# EAGLE design Arduino-Pro-v16 (EAGLE 7.4.0)
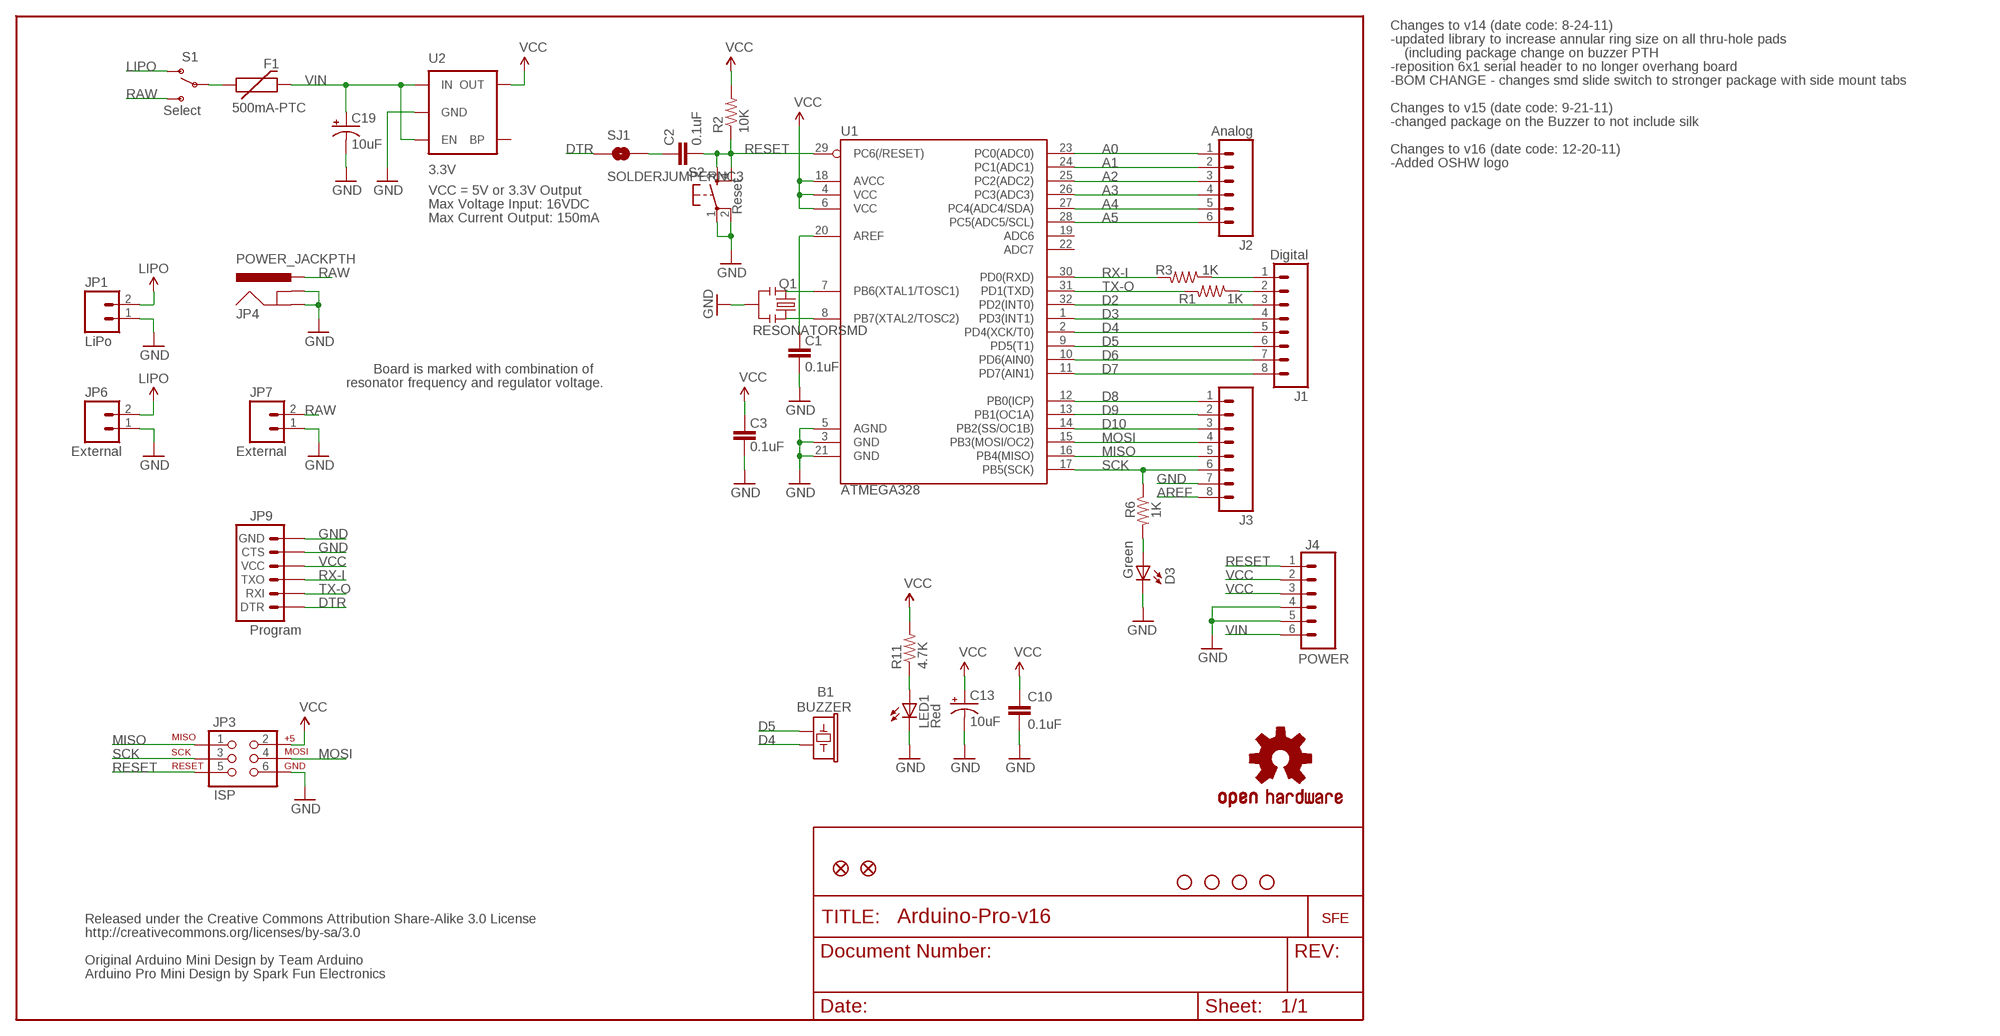
[diagram p0: schematic, sheet 1]

## Parts
B1  BUZZER  BUZZERPTH-NS-KIT  [BUZZER-12MM-NS-KIT]
C1  0.1uF  CAP0402-CAP  [0402-CAP]
C2  0.1uF  CAP0402-CAP  [0402-CAP]
C3  0.1uF  CAP0402-CAP  [0402-CAP]
C10  0.1uF  CAP0402-CAP  [0402-CAP]
C13  10uF  CAP_POL1206  [EIA3216]
C19  10uF  CAP_POL1206  [EIA3216]
D3  Green  LED0603  [LED-0603]
F1  500mA-PTC  PTCSMD  [PTC-1206]
J1  Digital  M081X08  [1X08]
J2  Analog  M06SIP  [1X06]
J3  M081X08  [1X08]
J4  POWER  M06SIP  [1X06]
JP1  LiPo  M02-JST-2MM-SMT  [JST-2-SMD]
JP2  FIDUCIAL1X2.5  [FIDUCIAL-1X2.5]
JP3  ISP  AVR_SPI_PRG_6PTH  [2X3]
JP4  POWER_JACKPTH  [POWER_JACK_PTH]
JP5  FIDUCIAL1X2.5  [FIDUCIAL-1X2.5]
JP6  External  M02PTH  [1X02]
JP7  External  M02PTH  [1X02]
JP9  Program  ARDUINO_SERIAL_PROGRAMSMD  [1X06-SMD]
LED1  Red  LED0603  [LED-0603]
Q1  RESONATORSMD  [RESONATOR-SMD]
R1  1K  RESISTOR0402-RES  [0402-RES]
R2  10K  RESISTOR0402-RES  [0402-RES]
R3  1K  RESISTOR0402-RES  [0402-RES]
R6  1K  RESISTOR0402-RES  [0402-RES]
R11  4.7K  RESISTOR0402-RES  [0402-RES]
S1  Select  SWITCH-SPST-SMD-A  [SWITCH-SPST-SMD-A]
S2  Reset  TAC_SWITCHSMD  [TACTILE_SWITCH_SMD]
SJ1  SOLDERJUMPERNC3  SOLDERJUMPERNC2  [SJ_2S-NOTRACE]
U1  ATMEGA328  ATMEGA168  [TQFP32-08]
U2  3.3V  V_REG_LDOSMD  [SOT23-5]
U$1  STAND-OFF  [STAND-OFF]
U$2  OSHW-LOGOL  [OSHW-LOGO-L]
U$3  STAND-OFF  [STAND-OFF]
U$9  STAND-OFF  [STAND-OFF]
U$10  STAND-OFF  [STAND-OFF]
U$11  LOGO-SFENEW  [SFE-NEW-WEBLOGO]

## Nets
A0: J2.1 U1.23(PC0(ADC0))
A1: J2.2 U1.24(PC1(ADC1))
A2: J2.3 U1.25(PC2(ADC2))
A3: J2.4 U1.26(PC3(ADC3))
A4: J2.5 U1.27(PC4(ADC4/SDA))
A5: J2.6 U1.28(PC5(ADC5/SCL))
AREF: C1.2 J3.8 U1.20(AREF)
D2: J1.3 U1.32(PD2(INT0))
D3: J1.4 U1.1(PD3(INT1))
D4: B1.- J1.5 U1.2(PD4(XCK/T0))
D5: B1.+ J1.6 U1.9(PD5(T1))
D6: J1.7 U1.10(PD6(AIN0))
D7: J1.8 U1.11(PD7(AIN1))
D8: J3.1 U1.12(PB0(ICP))
D9: J3.2 U1.13(PB1(OC1A))
D10: J3.3 U1.14(PB2(SS/OC1B))
DTR: JP9.1(DTR) SJ1.1
GND [vcc]: C1.1 C3.1 C10.2 C13.C(-) C19.C(-) D3.C J3.7 J4.4 J4.5 JP1.1 JP3.6 JP4.GND JP4.GNDBREAK JP6.1 JP7.1 JP9.5(CTS) JP9.6(GND) LED1.C Q1.2 S2.1 S2.2 U1.3(GND) U1.5(AGND) U1.21(GND) U2.2(GND)
LIPO: JP1.2 JP6.2 S1.1(O)
MISO: J3.5 JP3.1 U1.16(PB4(MISO))
MOSI: J3.4 JP3.4 U1.15(PB3(MOSI/OC2))
N$1: C2.1 SJ1.2
N$3: Q1.1 U1.8(PB7(XTAL2/TOSC2))
N$4: Q1.3 U1.7(PB6(XTAL1/TOSC1))
N$7: D3.A R6.2
N$25: F1.1 S1.2(P)
N$38: LED1.A R11.1
RAW [vcc]: JP4.PWR JP7.2 S1.3(S)
RESET: C2.2 J4.1 JP3.5 R2.1 S2.3 S2.4 U1.29(PC6(/RESET))
RX-I: JP9.3(TXO) R3.2 U1.30(PD0(RXD))
RX-IP: J1.2 R1.1
SCK: J3.6 JP3.3 R6.1 U1.17(PB5(SCK))
TX-O: JP9.2(RXI) R1.2 U1.31(PD1(TXD))
TX-OP: J1.1 R3.1
VCC: C3.2 C10.1 C13.A(+) J4.2 J4.3 JP3.2 JP9.4(VCC) R2.2 R11.2 U1.4(VCC) U1.6(VCC) U1.18(AVCC) U2.5(OUT)
VIN [vcc]: C19.A(+) F1.2 J4.6 U2.1(IN) U2.3(EN)
Unconnected: U1.19(ADC6) U1.22(ADC7) U2.4(BP)

## Notes on the sheet
- Changes to v14 (date code: 8-24-11)
- -updated library to increase annular ring size on all thru-hole pads
- (including package change on buzzer PTH
- -reposition 6x1 serial header to no longer overhang board
- -BOM CHANGE - changes smd slide switch to stronger package with side mount tabs
- Changes to v15 (date code: 9-21-11)
- -changed package on the Buzzer to not include silk
- Changes to v16 (date code: 12-20-11)
- -Added OSHW logo
- VCC = 5V or 3.3V Output
- Max Voltage Input: 16VDC
- Max Current Output: 150mA
- Board is marked with combination of
- resonator frequency and regulator voltage.
- Released under the Creative Commons Attribution Share-Alike 3.0 License
- http://creativecommons.org/licenses/by-sa/3.0
- Original Arduino Mini Design by Team Arduino
- Arduino Pro Mini Design by Spark Fun Electronics

## Library data of the parts
B1 = SparkFun:BUZZER: Buzzer 12mm Spark Fun Electronics SKU : Comp-Buzzer
C1-C3 C10 = SparkFun:CAP: Capacitor Standard 0603 ceramic capacitor, and 0.1" leaded capacitor.
C13 C19 = SparkFun:CAP_POL: Capacitor Polarized These are standard SMD and PTH capacitors. Normally 10uF, 47uF, and 100uF in electrolytic and tantalum varieties. Always verify the external diameter of the through hole cap, it varies with capacity, voltage, and manufacturer. The EIA devices should be standard.
D3 LED1 = SparkFun:LED: LEDs Standard schematic elements and footprints for 5mm, 3mm, 1206, and 0603 sized LEDs. 5mm - Spark Fun Electronics SKU : COM-00529 (and others)
F1 = SparkFun:PTC: Resettable Fuse PTC Resettable Fuse. Spark Fun Electronics SKU : COM-08357
J1 J3 = SparkFun:M08: Header 8 Standard 8-pin 0.1" header. Use with straight break away headers (SKU : PRT-00116), right angle break away headers (PRT-00553), swiss pins (PRT-00743), machine pins (PRT-00117), and female headers (PRT-00115).
J2 J4 = SparkFun:M06: Header 6 Standard 6-pin 0.1" header. Use with straight break away headers (SKU : PRT-00116), right angle break away headers (PRT-00553), swiss pins (PRT-00743), machine pins (PRT-00117), and female headers (PRT-00115). Molex polarized connector foot print use with SKU : PRT-08094 with associated crimp pins and housings. NOTES ON THE VARIANTS LOCK and LOCK_LONGPADS... This footprint was designed to help hold the alignment of a through-hole component (i.e. 6-pin header) while soldering it into place. You may notice that each hole has been shifted either up or down by 0.005 of an inch from it's more standard position (which is a perfectly straight line). This slight alteration caused the pins (the squares in the middle) to touch the edges of the holes. Because they are alternating, it causes a "brace" to hold the component in place. 0.005 has proven to be the perfect amount of "off-center" position when using our standard breakaway headers. Although looks a little odd when you look at the bare footprint, once you have a header in there, the alteration is very hard to notice. Also, if you push a header all the way into place, it is covered up entirely on the bottom side. This idea of altering the position of holes to aid alignment will be further integrated into the Sparkfun Library for other footprints. It can help hold any component with 3 or more connection pins.
JP1 JP6 JP7 = SparkFun:M02: Header 2 Standard 2-pin 0.1" header. Use with straight break away headers (SKU : PRT-00116), right angle break away headers (PRT-00553), swiss pins (PRT-00743), machine pins (PRT-00117), and female headers (PRT-00115). Molex polarized connector foot print use with SKU : PRT-08233 with associated crimp pins and housings.
JP2 JP5 = abes:FIDUCIAL: Fiducial Alignment Points Various fiducial points for machine vision alignment.
JP3 = SparkFun:AVR_SPI_PRG_6: AVR ISP 6 Pin This is the reduced ISP connector for AVR programming. Common on Arduino. This footprint will take up less PCB space and can be used with a 10-pin to 6-pin adapter such as SKU: BOB-08508
JP4 = SparkFun:POWER_JACK: Power Jack This is the standard 5.5mm barrel jack for power. The PTH is the most common, proven, reliable, footprint. All others are experimental. The Slot footprint only works if the mill layer is transmitted to the PCB fab house so be warned. Spark Fun Electronics SKU : PRT-00119. Mating wall wart : TOL-00298 (and others)
JP9 = SparkFun:ARDUINO_SERIAL_PROGRAM
Q1 = SparkFun:RESONATOR: Resonator Small SMD resonator. This is the itty bitty 10/20MHz resonators with built in caps. CSTCE10M0G55 and CSTCE20M0V53. Footprint has been reviewed closely but hasn't been tested yet.
R1-R3 R6 R11 = SparkFun:RESISTOR: Resistor Basic schematic elements and footprints for 0603, 1206, and PTH resistors.
S1 = SparkFun:SWITCH-SPST: SPST Switch Simple slide switch. Spark Fun Electronics SKU : COM-00102
S2 = SparkFun:TAC_SWITCH: Momentary Switch Button commonly used for reset or general input. Spark Fun Electronics SKU : COM-00097
SJ1 = SparkFun:SOLDERJUMPER: Solder Jumper Standard SMD solder jumper. Used to automate production. Two varients : Normally Open and Normally Closed are the same, but have different paste layers. NC will have a large amount of paste and should jumper during reflow.
U1 = SparkFun:ATMEGA168
U2 = SparkFun:V_REG_LDO: Voltage Regulator LDO Standard 150mA LDO voltage regulator in SOT-23 layout. Micrel part MIC5205. BP (by-pass) pin is used to lower output noise with 470pF cap.
U$1 U$3 U$9 U$10 = SparkFun:STAND-OFF: Stand Off This is the mechanical footprint for a #4 phillips button head screw. Use the keepout ring to avoid running the screw head into surrounding components. SKU : PRT-00447
U$2 = SparkFun:OSHW-LOGO: Open Source Hardware Logo This logo indicates the piece of hardware it is found on incorporates a OSHW license and/or adheres to the definition of open source hardware found here: http://freedomdefined.org/OSHW
U$11 = SparkFun:LOGO-SFE: Spark Fun Electronics PCB Logo This is the standard Spark Fun Electronics PCB logo.

## Net classes
0 default: width 0.203 mm
1 vcc: width 0.254 mm

## Board
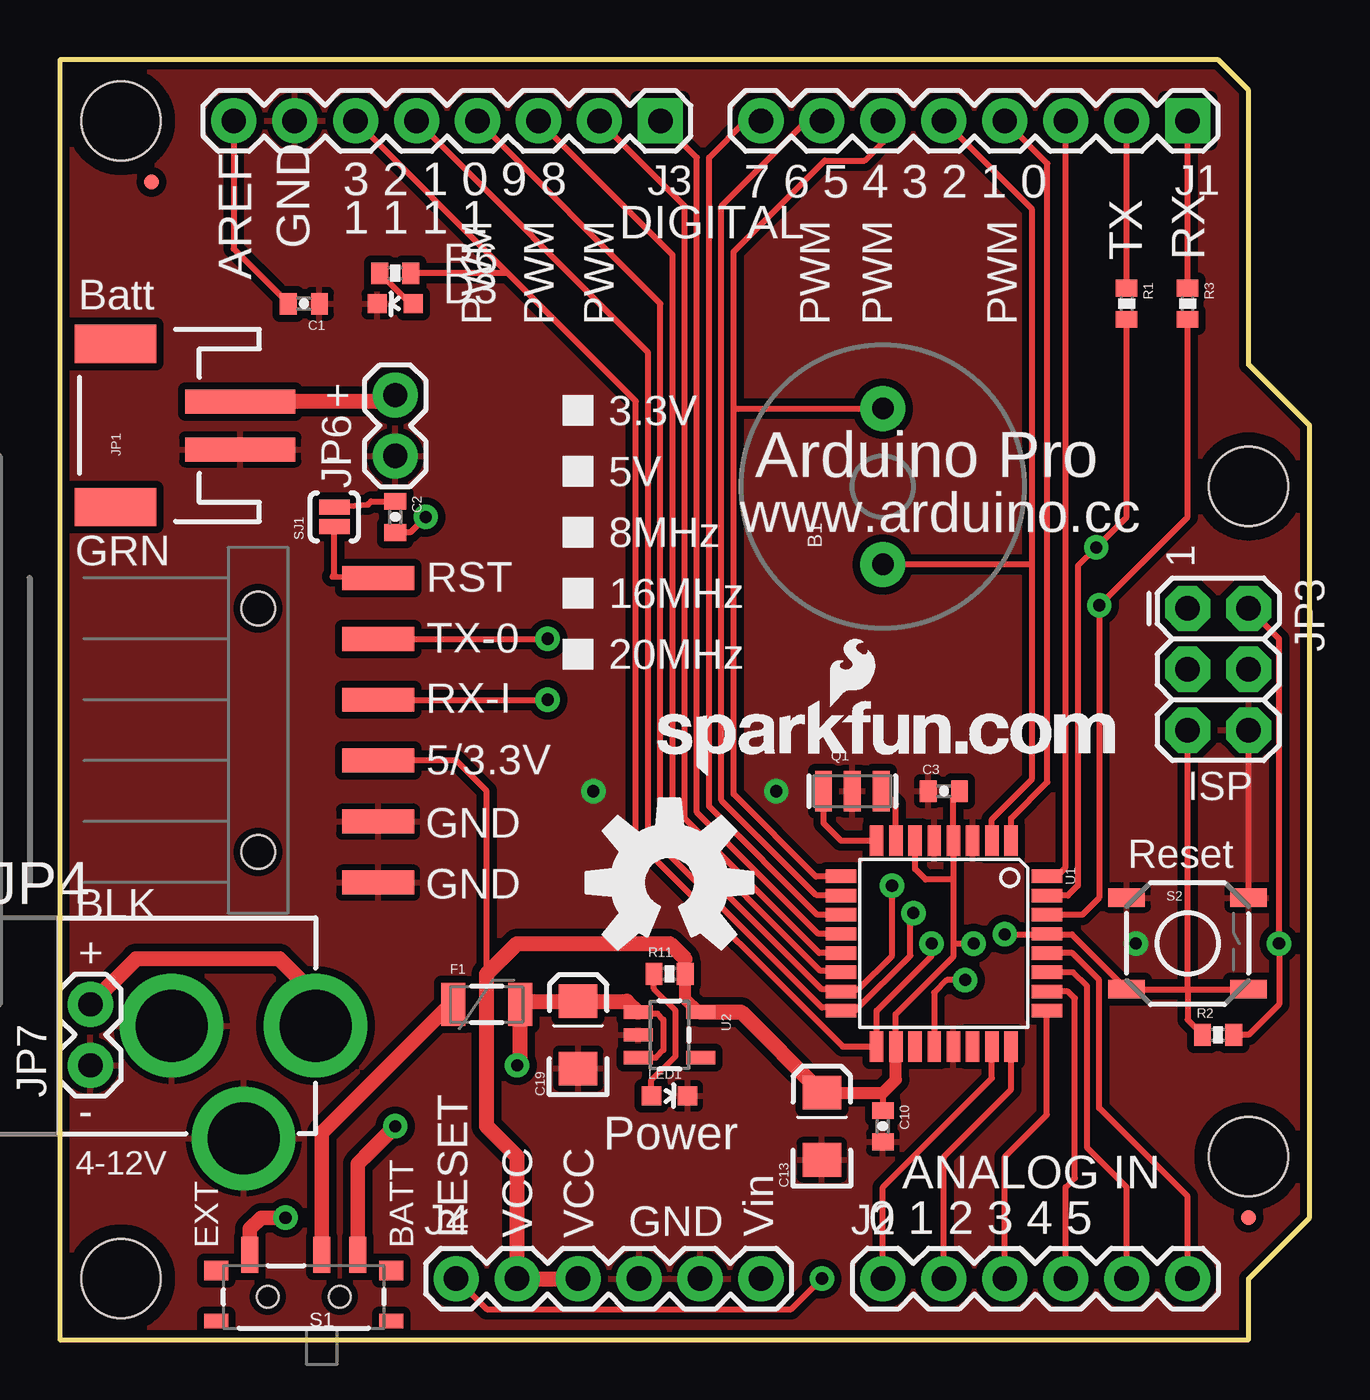
[diagram p1: board, top side]
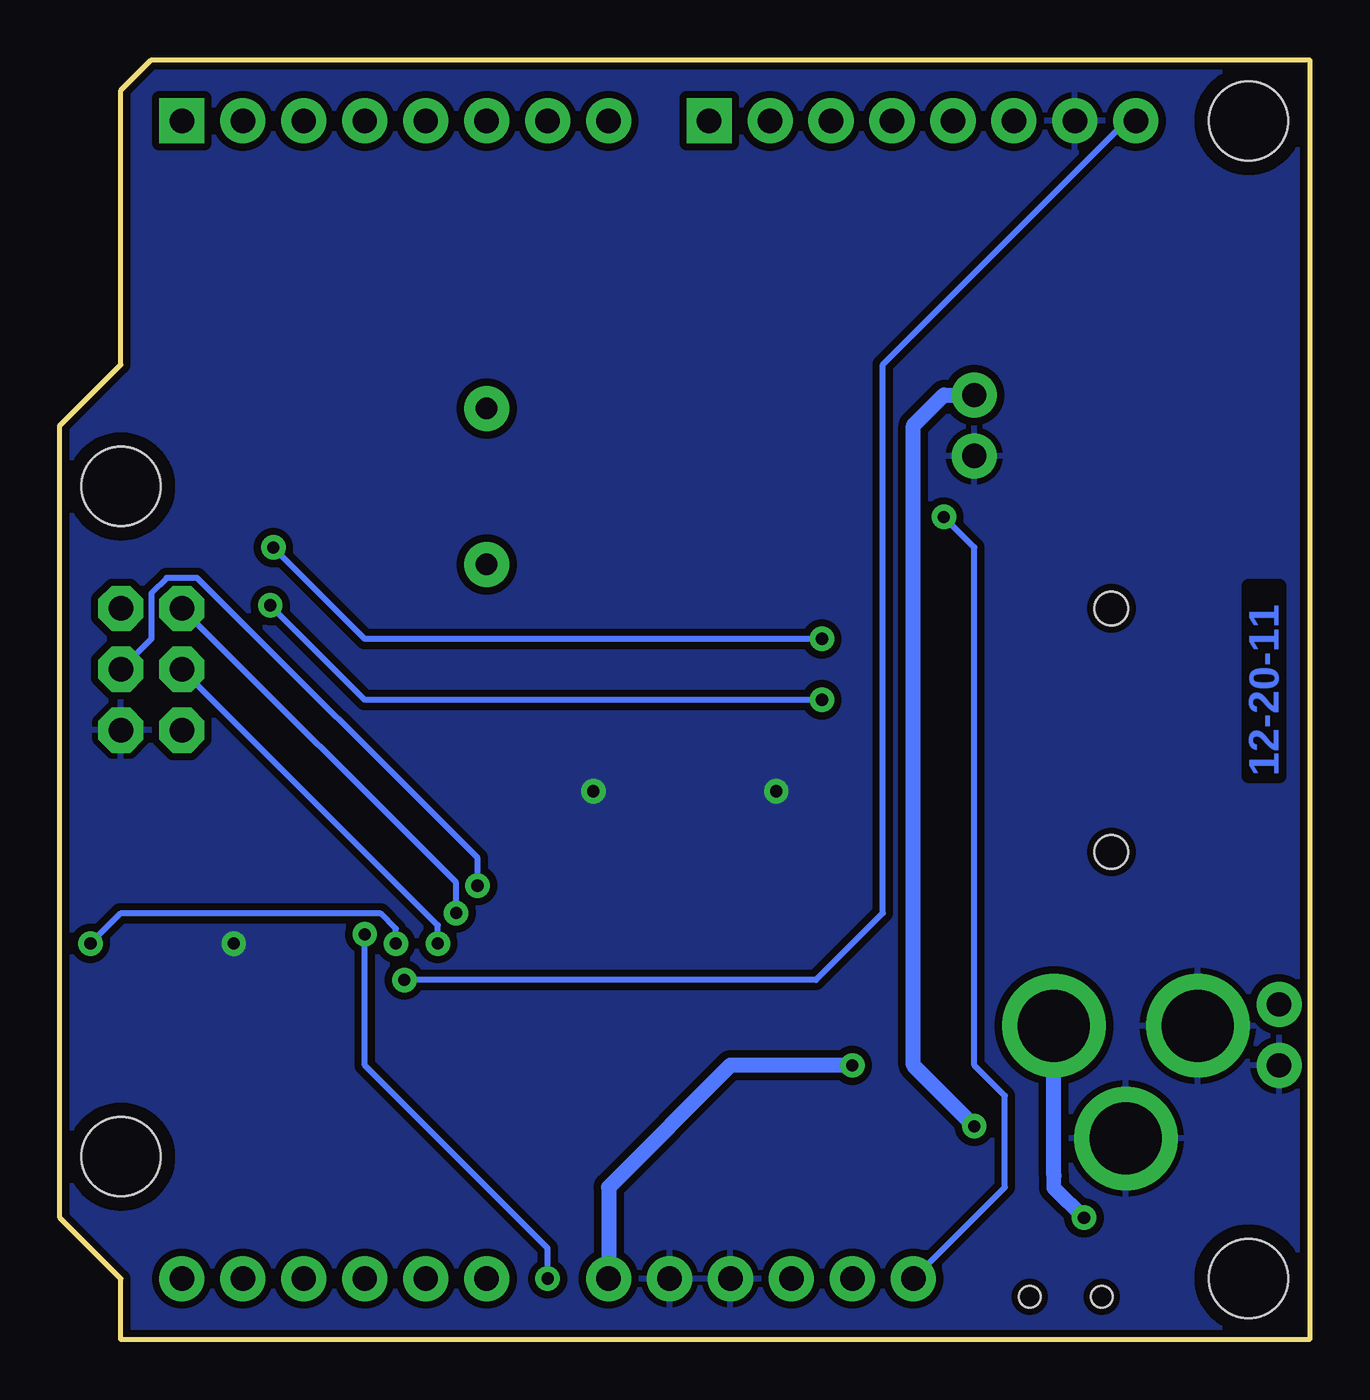
[diagram p2: board, bottom side, seen from below]

Size 52.07 x 53.34 mm. Coordinates in mm from the lower left corner, seen from the top.
Outline: 0,53.34 0,0 49.53,0 49.53,2.54 52.07,5.08 52.07,38.1 49.53,40.64 49.53,52.07 48.26,53.34 0,53.34
Copper layers (1*16): Top 0.035mm / dielectric 1.5mm / Bottom 0.035mm
Design rules "SparkFun": minimum track width 8mil, minimum drill 20mil, track to track 8mil, track to pad 8mil, pad to pad 8mil, via to via 8mil, smd to smd 8mil, copper to edge 10mil, drill to drill 8mil, minimum pad ring 12mil, minimum via ring 10mil, stop-mask expansion 4mil, vias tented up to drill 20mil, thermal gap 10mil

### Footprints (pad centres in the part's own frame; a part is rotated, then mirrored left to right if it is on the bottom)
BUZZER-12MM-NS-KIT = drill 0.9 pad 1.88: + 3.25,0; - -3.25,0
0402-CAP = smd 0.7 x 0.9: 1 -0.65,0; 2 0.65,0
EIA3216 = smd 1.4 x 1.6: A 1.4,0; C -1.4,0
LED-0603 = smd 0.8 x 0.8: A 0,-0.75; C 0,0.75
PTC-1206 = smd 1 x 1.8: 1 -1.4,0; 2 1.4,0
1X08 = drill 1.016 pad 1.88 square: 1 0,0 | drill 1.016 pad 1.88: 2 2.54,0; 3 5.08,0; 4 7.62,0; 5 10.16,0; 6 12.7,0; 7 15.24,0; 8 17.78,0
1X06 = drill 1.016 pad 1.88: 1 0,0; 2 2.54,0; 3 5.08,0; 4 7.62,0; 5 10.16,0; 6 12.7,0
JST-2-SMD = smd 1 x 4.6: 1 -1,-3.7; 2 1,-3.7 | smd 1.6 x 3.4: NC1 -3.4,1.5; NC2 3.4,1.5
FIDUCIAL-1X2.5 = smd 0.635 x 0.635: 1 0,0
2X3 = drill 1.016 pad 1.88 octagon: 1 0,0; 2 0,2.54; 3 2.54,0; 4 2.54,2.54; 5 5.08,0; 6 5.08,2.54
POWER_JACK_PTH = drill 2.997 pad 4.318: GND 0,7.7; GNDBREAK 4.7,10.7; PWR 0,13.7
1X02 = drill 1.016 pad 1.88: 1 0,0; 2 2.54,0
1X06-SMD = smd 1 x 3: 1 -6.35,5; 2 -3.81,5; 3 -1.27,5; 4 1.27,5; 5 3.81,5; 6 6.35,5 | hole 1.4: -5.08,0; 5.08,0
RESONATOR-SMD = smd 0.7 x 1.7: 1 -1.2,0; 2 0,0; 3 1.2,0
0402-RES = smd 0.7 x 0.9: 1 -0.65,0; 2 0.65,0
SWITCH-SPST-SMD-A = smd 0.7 x 1.5: 1 -2.25,-1.75; 2 -0.75,-1.75; 3 2.25,-1.75 | smd 1 x 0.6: GND1 -3.65,1; GND3 3.65,1 | smd 1 x 0.8: GND2 -3.65,-1.1; GND4 3.65,-1.1 | hole 0.9: -1.5,0; 1.5,0
TACTILE_SWITCH_SMD = smd 1.524 x 0.762: 1 -2.54,1.905; 2 2.54,1.905; 3 -2.54,-1.905; 4 2.54,-1.905
SJ_2S-NOTRACE = smd 0.635 x 1.27: 1 -0.401,0; 2 0.413,0
TQFP32-08 = smd 1.27 x 0.559: 1 -4.293,2.8; 2 -4.293,2; 3 -4.293,1.2; 4 -4.293,0.4; 5 -4.293,-0.4; 6 -4.293,-1.2; 7 -4.293,-2; 8 -4.293,-2.8; 17 4.293,-2.8; 18 4.293,-2; 19 4.293,-1.2; 20 4.293,-0.4; 21 4.293,0.4; 22 4.293,1.2; 23 4.293,2; 24 4.293,2.8 | smd 0.559 x 1.27: 9 -2.8,-4.293; 10 -2,-4.293; 11 -1.2,-4.293; 12 -0.4,-4.293; 13 0.4,-4.293; 14 1.2,-4.293; 15 2,-4.293; 16 2.8,-4.293; 25 2.8,4.293; 26 2,4.293; 27 1.2,4.293; 28 0.4,4.293; 29 -0.4,4.293; 30 -1.2,4.293; 31 -2,4.293; 32 -2.8,4.293
SOT23-5 = smd 0.55 x 1.2: 1 -0.95,-1.3; 2 0,-1.3; 3 0.95,-1.3; 4 0.95,1.3; 5 -0.95,1.3
STAND-OFF = hole 3.302: 0,0

### Placement (x,y rotation side)
B1  34.29,35.56 90 top
C1  10.16,43.18 180 top
C2  13.97,34.29 270 top
C3  36.83,22.86 0 top
C10  34.29,8.89 270 top
C13  31.75,8.89 90 top
C19  21.59,12.7 90 top
D3  13.97,43.18 90 top
F1  17.78,13.97 0 top
J1  46.99,50.8 180 top
J2  34.29,2.54 0 top
J3  25.02,50.8 180 top
J4  16.51,2.54 0 top
JP1  3.81,38.1 90 top
JP2  49.53,5.08 0 top
JP3  46.99,30.48 270 top
JP4  -3.05,13.08 270 top
JP5  3.81,48.26 0 top
JP6  13.97,36.83 90 top
JP7  1.27,11.43 90 top
JP9  8.26,25.4 270 top
LED1  25.4,10.16 270 top
Q1  33.02,22.86 0 top
R1  44.45,43.18 270 top
R2  48.26,12.7 0 top
R3  46.99,43.18 270 top
R6  13.97,44.45 180 top
R11  25.4,15.24 0 top
S1  10.16,1.78 180 top
S2  46.99,16.51 0 top
SJ1  11.43,34.29 90 top
U1  36.83,16.51 270 top
U2  25.4,12.7 270 top
U$1  2.54,50.8 0 top
U$2  25.4,19.05 0 top
U$3  2.54,2.54 0 top
U$9  49.53,35.56 0 top
U$10  49.53,7.62 0 top
U$11  24.89,23.5 0 top

### Tracks (layer width: path | path; a pad name or v marks a point on that pad's centre or on a via)
A0
  Top 0.254: U1.23 38.83,10.89 34.29,6.35 J2.1
A1
  Top 0.254: U1.24 39.63,10.42 36.83,7.62 J2.2
A2
  Top 0.254: U1.25 41.12,9.37 39.37,7.62 39.37,2.79 39.5,2.67 J2.3
A3
  Top 0.254: U1.26 42.01,14.51 42.29,14.22 42.29,6.73 41.91,6.35 J2.4
A4
  Top 0.254: U1.27 42.22,15.31 42.8,14.73 42.8,8 44.45,6.35 J2.5
A5
  Top 0.254: U1.28 42.18,16.11 43.31,14.99 43.31,9.65 46.99,5.97 J2.6
AREF  (via drill 0.51)
  Top 0.254: U1.20 36.43,14.46 36.96,14.99 v37.72,14.99 | C1.2 9.53,43.18 7.24,45.47 J3.8
  Bottom 0.254: v37.72,14.99 20.57,14.99 17.78,17.78 17.78,40.64 7.62,50.8 J3.8
D2
  Top 0.254: U1.32 41.52,19.31 41.53,19.3 41.91,19.68 J1.3
D3
  Top 0.254: U1.1 39.63,21.72 41.15,23.24 41.15,49.02 J1.4
D4
  Top 0.254: U1.2 38.83,21.68 40.51,23.37 40.51,32.26 | 40.51,32.26 40.51,47.12 J1.5 | B1.- 40.46,32.31 40.51,32.26
D5
  Top 0.254: U1.9 32.64,19.3 | U1.9 | U1.9 31.5,19.3 28.07,22.73 28.07,38.86 | 28.07,38.86 28.07,45.34 31.88,49.15 33.53,49.15 34.29,49.91 J1.6 | B1.+ 28.12,38.81 28.07,38.86
D6
  Top 0.254: U1.10 32.42,18.51 32.38,18.54 31.5,18.54 27.56,22.48 27.56,47.24 31.11,50.8 J1.7
D7
  Top 0.254: U1.11 31.57,17.71 27.05,22.23 27.05,49.28 28.57,50.8 J1.8
D8
  Top 0.254: U1.12 31.6,16.91 26.54,21.97 26.54,49.28 J3.1
D9
  Top 0.254: U1.13 31.64,16.11 26.04,21.72 26.04,47.24 J3.2
D10
  Top 0.254: J3.3 25.53,45.21 25.53,21.53 31.69,15.37 32.51,15.37 32.51,15.34 U1.14
DTR
  Top 0.254: JP9.1 11.35,31.8 11.43,31.88 SJ1.1
GND  (via drill 0.51)
  Top 0.254: S2.2 JP3.6
  other vias: 29.84,22.86 22.23,22.86 44.83,16.51
  pour Top (isolate 0.305): 0,53.34 52.07,53.34 52.07,0 0,0
  pour Bottom (isolate 0.305): 0,53.34 52.07,53.34 52.07,0 0,0
LIPO  (via drill 0.51)
  Top 0.61: 12.7,7.62 12.41,7.33 S1.1
  Top 0.635: JP1.2 13.7,39.1 JP6.2 | 12.7,7.62 v13.97,8.89
  Bottom 0.635: JP6.2 15.24,39.37 16.51,38.1 16.51,11.43 v13.97,8.89
MISO  (via drill 0.51)
  Top 0.254: J3.5 24.51,41.15 24.51,21.08 31.75,13.84 32.64,13.84 32.54,13.74 U1.16 | U1.16 | U1.16 32.63,13.71 32.64,13.72 33.15,13.72 35.43,16 35.43,17.65 v35.56,17.78
  Bottom 0.254: JP3.1 35.56,19.05 v35.56,17.78
MOSI  (via drill 0.51)
  Top 0.254: J3.4 25.02,43.18 25.02,21.34 31.75,14.61 32.51,14.61 32.54,14.58 U1.15 | 32.64,14.48 32.57,14.48 U1.15 | v34.67,18.92 34.67,16 33.27,14.61 32.77,14.61 32.64,14.48 | 32.64,14.48 32.61,14.51 U1.15
  Bottom 0.254: JP3.4 48.26,29.21 48.26,31.11 47.62,31.75 46.35,31.75 34.67,20.07 v34.67,18.92
N$1
  Top 0.254: C2.1 12.97,34.94 12.83,34.8 SJ1.2
N$3
  Top 0.254: U1.8 32.54,20.8 31.82,21.52 Q1.1
N$4
  Top 0.254: Q1.3 34.29,22.86 34.83,22.32 U1.7
N$7
  Top 0.254: D3.A 14.61,43.18 13.34,44.45 R6.2
N$25
  Top 0.61: F1.1 16.26,13.97 10.91,8.62 S1.2
  Top 0.635: F1.1 16.51,13.97
N$38
  Top 0.254: R11.1 24.75,14.62 25.65,13.72 25.65,11.81 24.64,10.79 24.64,10.16 LED1.A
RAW  (via drill 0.51)
  Top 0.61: v9.4,5.08 8.38,5.08 7.91,4.61 S1.3
  Top 0.635: JP7.2 3.17,15.88 9.14,15.88 10.67,14.35 10.67,12.7 JP4.PWR
  Bottom 0.61: 10.65,6.84 10.65,6.33 v9.4,5.08
  Bottom 0.635: 10.65,6.84 JP4.PWR
RESET  (via drill 0.51)
  Top 0.254: S2.4 49.66,14.61 | J4.1 17.78,1.27 30.48,1.27 v31.75,2.54 | v39.37,16.89 41.02,16.89 41.04,16.91 U1.29 41.26,16.91 41.27,16.89 42.16,16.89 S2.3 46.99,14.61 | S2.4 49.4,14.61 | 46.99,14.61 JP3.5 | R2.1 47.62,12.7 46.99,13.34 46.99,14.61 | 46.99,14.61 S2.4 | C2.2 14.59,33.64 v15.24,34.29
  Bottom 0.254: v39.37,16.89 39.37,11.43 31.75,3.81 v31.75,2.54 | J4.1 12.7,6.35 12.7,10.16 13.97,11.43 13.97,33.02 v15.24,34.29
RX-I  (via drill 0.51)
  Top 0.254: U1.30 42.6,17.71 43.31,18.41 v43.31,30.61 46.99,34.29 R3.2 | JP9.3 v20.32,26.67
  Bottom 0.254: v20.32,26.67 39.37,26.67 v43.31,30.61
RX-IP
  Top 0.254: R1.1 J1.2
SCK  (via drill 0.51)
  Top 0.254: 18.67,44.45 24,39.12 24,20.83 32.61,12.22 U1.17 34.03,13.71 36.32,16 v36.32,16.51 | 18.67,44.45 J3.6 | 14.62,44.47 R6.1 18.67,44.45
  Bottom 0.254: v36.32,16.51 36.32,17.27 JP3.3
TX-O  (via drill 0.51)
  Top 0.254: U1.31 42.01,18.51 42.42,18.92 42.42,32.26 v43.18,33.02 44.45,34.29 R1.2 | JP9.2 v20.32,29.21
  Bottom 0.254: v20.32,29.21 39.37,29.21 v43.18,33.02
TX-OP
  Top 0.254: R3.1 J1.1
VCC  (via drill 0.51)
  Top 0.254: 34.29,10.29 C10.1 | C13.A 31.75,10.16 | 26.54,13.59 26.6,13.65 26.61,13.65 U2.5 | U1.18 34.82,13.56 37.24,15.98 37.24,16.51 | U1.4 37.24,20.9 | U1.4 37.23,22.57 37.52,22.86 C3.2 | 37.24,16.51 37.24,19.18 | 37.24,19.18 U1.4 | JP3.2 50.8,29.21 v50.8,16.51 50.8,13.97 49.53,12.7 R2.2 | 37.24,16.51 v38.08,16.51 | 17.78,15.24 17.78,22.86 16.51,24.13 JP9.4 | U1.6 35.63,19.61 36.07,19.18 37.24,19.18
  Top 0.508: U1.18 34.83,10.83 34.29,10.29 31.88,10.29 | 26.05,15.86 R11.2 26.04,15.24 26.04,14.22 26.61,13.65
  Top 0.635: U2.5 28.39,13.65 C13.A 31.87,10.29 31.88,10.29 | 26.05,15.86 25.4,16.51 19.05,16.51 17.78,15.24 17.78,8.89 19.05,7.62 J4.2 J4.3
  Bottom 0.254: v38.08,16.51 38.08,17.12 38.71,17.75 49.55,17.75 v50.8,16.51
VIN  (via drill 0.51)
  Top 0.254: U2.3 24.83,11.75 25.15,12.06 25.15,13.34 24.89,13.59 24.13,13.59 24.1,13.62 U2.1
  Top 0.635: U2.1 24.07,13.65 23.62,14.1 C19.A 19.18,14.1 19.05,13.97 F1.2 19.18,11.56 v19.05,11.43
  Bottom 0.635: J4.6 29.21,6.35 24.13,11.43 v19.05,11.43

### Text on the board
Bottom: 12-20-11
tPlace: Released under the Creative Commons Attribution Share-Alike 3.0 License | http://creativecommons.org/licenses/by-sa/3.0 | 3 2 1 0 9 8 | 7 6 5 4 3 2 1 0 | 1 1 1 1 | DIGITAL | GND | TX | RX | AREF | Batt | PWM | PWM | PWM | PWM | PWM | PWM | + | 3.3V | - | 5V | Arduino Pro | www.arduino.cc | 8MHz | GRN | 1 | RST | 16MHz | TX-0 | 20MHz | RX-I | 5/3.3V | ISP | GND | Reset | BLK | GND | + | - | Power | 4-12V | ANALOG IN | EXT | BATT | RESET | VCC | VCC | GND | Vin | 0 1 2 3 4 5
tValues: DNP | DNP | JST-Right Angle | DNP | Production: DNP | Production: DNP | Proto: 2x3 male header up | DNP | DNP | DNP | Arduino Pro